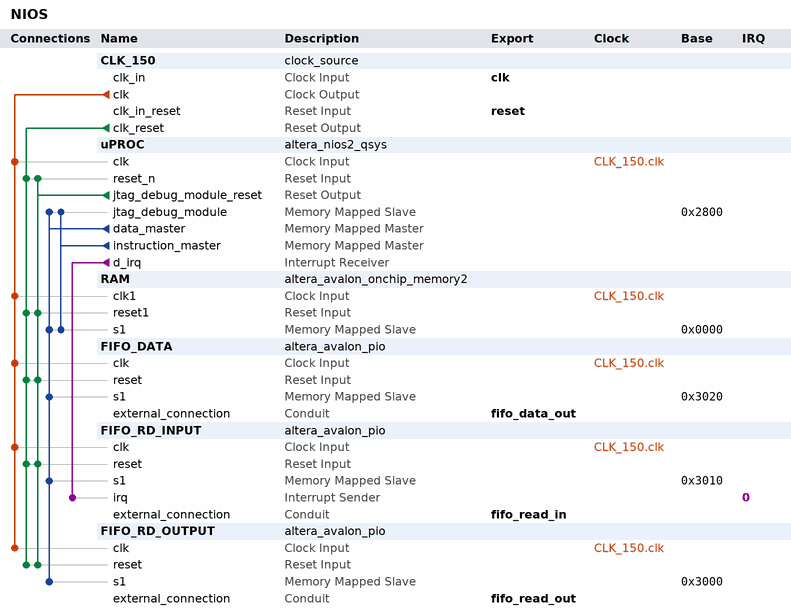
[diagram p0: system contents]
# Platform Designer (Qsys) system NIOS, Cyclone II EP2C70F896C6
# Parameters at their usual value, and those the tool derives, are not listed.
package require -exact qsys 13.0.1.99.2
create_system NIOS
set_project_property DEVICE_FAMILY {Cyclone II}
set_project_property DEVICE EP2C70F896C6

add_instance CLK_150 clock_source 13.0
set_instance_parameter_value CLK_150 clockFrequency 150000000

add_instance uPROC altera_nios2_qsys 13.0
set_instance_parameter_value uPROC resetSlave RAM.s1
set_instance_parameter_value uPROC mmu_TLBMissExcSlave None
set_instance_parameter_value uPROC exceptionSlave RAM.s1
set_instance_parameter_value uPROC breakSlave uPROC.jtag_debug_module
set_instance_parameter_value uPROC impl Tiny
set_instance_parameter_value uPROC icache_size 4096

add_instance RAM altera_avalon_onchip_memory2 13.0.1.99.2
set_instance_parameter_value RAM dataWidth 32
set_instance_parameter_value RAM dualPort false
set_instance_parameter_value RAM initMemContent true
set_instance_parameter_value RAM initializationFileName onchip_mem.hex
set_instance_parameter_value RAM memorySize 8192

add_instance FIFO_DATA altera_avalon_pio 13.0.1.99.2
set_instance_parameter_value FIFO_DATA direction Input
set_instance_parameter_value FIFO_DATA width 16

add_instance FIFO_RD_INPUT altera_avalon_pio 13.0.1.99.2
set_instance_parameter_value FIFO_RD_INPUT direction Input
set_instance_parameter_value FIFO_RD_INPUT generateIRQ true
set_instance_parameter_value FIFO_RD_INPUT width 1

add_instance FIFO_RD_OUTPUT altera_avalon_pio 13.0.1.99.2
set_instance_parameter_value FIFO_RD_OUTPUT direction Output
set_instance_parameter_value FIFO_RD_OUTPUT width 1

# connections
add_connection CLK_150.clk FIFO_DATA.clk clock
add_connection CLK_150.clk FIFO_RD_INPUT.clk clock
add_connection CLK_150.clk FIFO_RD_OUTPUT.clk clock
add_connection CLK_150.clk RAM.clk1 clock
add_connection CLK_150.clk uPROC.clk clock
add_connection CLK_150.clk_reset FIFO_DATA.reset reset
add_connection CLK_150.clk_reset FIFO_RD_INPUT.reset reset
add_connection CLK_150.clk_reset FIFO_RD_OUTPUT.reset reset
add_connection CLK_150.clk_reset RAM.reset1 reset
add_connection CLK_150.clk_reset uPROC.reset_n reset
add_connection uPROC.jtag_debug_module_reset FIFO_DATA.reset reset
add_connection uPROC.jtag_debug_module_reset FIFO_RD_INPUT.reset reset
add_connection uPROC.jtag_debug_module_reset FIFO_RD_OUTPUT.reset reset
add_connection uPROC.jtag_debug_module_reset RAM.reset1 reset
add_connection uPROC.jtag_debug_module_reset uPROC.reset_n reset
add_connection uPROC.data_master FIFO_DATA.s1 avalon
set_connection_parameter_value uPROC.data_master/FIFO_DATA.s1 baseAddress 0x3020
add_connection uPROC.data_master FIFO_RD_INPUT.s1 avalon
set_connection_parameter_value uPROC.data_master/FIFO_RD_INPUT.s1 baseAddress 0x3010
add_connection uPROC.data_master FIFO_RD_OUTPUT.s1 avalon
set_connection_parameter_value uPROC.data_master/FIFO_RD_OUTPUT.s1 baseAddress 0x3000
add_connection uPROC.data_master RAM.s1 avalon
set_connection_parameter_value uPROC.data_master/RAM.s1 baseAddress 0x0000
add_connection uPROC.data_master uPROC.jtag_debug_module avalon
set_connection_parameter_value uPROC.data_master/uPROC.jtag_debug_module baseAddress 0x2800
add_connection uPROC.instruction_master RAM.s1 avalon
set_connection_parameter_value uPROC.instruction_master/RAM.s1 baseAddress 0x0000
add_connection uPROC.instruction_master uPROC.jtag_debug_module avalon
set_connection_parameter_value uPROC.instruction_master/uPROC.jtag_debug_module baseAddress 0x2800
add_connection uPROC.d_irq FIFO_RD_INPUT.irq interrupt
set_connection_parameter_value uPROC.d_irq/FIFO_RD_INPUT.irq irqNumber 0

# exported interfaces
add_interface clk clock sink
set_interface_property clk EXPORT_OF CLK_150.clk_in
add_interface fifo_data_out conduit end
set_interface_property fifo_data_out EXPORT_OF FIFO_DATA.external_connection
add_interface fifo_read_in conduit end
set_interface_property fifo_read_in EXPORT_OF FIFO_RD_INPUT.external_connection
add_interface fifo_read_out conduit end
set_interface_property fifo_read_out EXPORT_OF FIFO_RD_OUTPUT.external_connection
add_interface reset reset sink
set_interface_property reset EXPORT_OF CLK_150.clk_in_reset

set_interconnect_requirement {$system} qsys_mm.clockCrossingAdapter HANDSHAKE
set_interconnect_requirement {$system} qsys_mm.maxAdditionalLatency 1

save_system NIOS.qsys
